# EAGLE design P27_v2 (EAGLE 6.4)
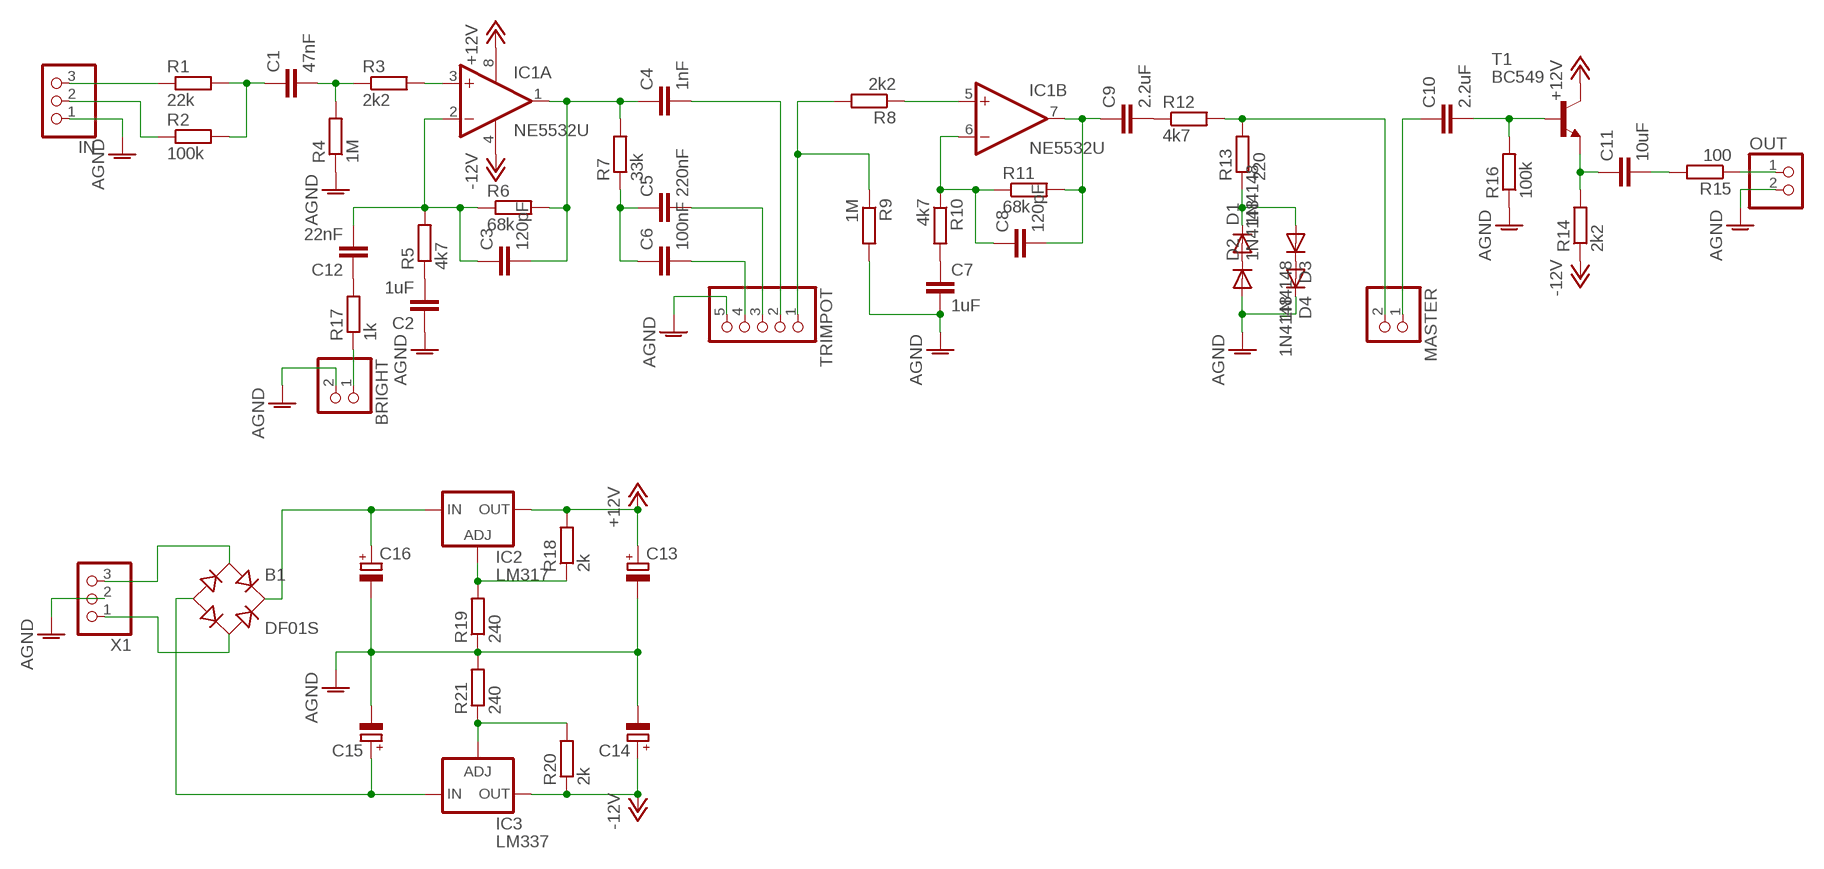
[diagram p0: schematic, sheet 1]

## Parts
B1  DF01S  [DFS]
BRIGHT  PINHD-1X2  [1X02]
C1  47nF  C-EUC0805K  [C0805K]
C2  1uF  C-EUC0805K  [C0805K]
C3  120pF  C-EUC0805K  [C0805K]
C4  1nF  C-EUC0805K  [C0805K]
C5  220nF  C-EUC0805K  [C0805K]
C6  100nF  C-EUC0805K  [C0805K]
C7  1uF  C-EUC0805K  [C0805K]
C8  120pF  C-EUC0805K  [C0805K]
C9  2.2uF  C-EUC1206  [C1206]
C10  2.2uF  C-EUC1206  [C1206]
C11  10uF  C-EUC1206  [C1206]
C12  22nF  C-EUC0805K  [C0805K]
C13  CPOL-EUD  [PANASONIC_D]
C14  CPOL-EUD  [PANASONIC_D]
C15  CPOL-EUD  [PANASONIC_D]
C16  CPOL-EUD  [PANASONIC_D]
D1  1N4148  [D0805]
D2  1N4148  [D0805]
D3  1N4148  [D0805]
D4  1N4148  [D0805]
IC1  NE5532U  [SO08]
IC2  LM317  [SOT223]
IC3  LM337  [SOT223]
IN  PINHD-1X3180  [1X03]
MASTER  PINHD-1X2  [1X02]
OUT  PINHD-1X2  [1X02]
R1  22k  R-EU_0805  [R0805]
R2  100k  R-EU_0805  [R0805]
R3  2k2  R-EU_0805  [R0805]
R4  1M  R-EU_0805  [R0805]
R5  4k7  R-EU_0805  [R0805]
R6  68k  R-EU_0805  [R0805]
R7  33k  R-EU_0805  [R0805]
R8  2k2  R-EU_0805  [R0805]
R9  1M  R-EU_0805  [R0805]
R10  4k7  R-EU_0805  [R0805]
R11  68k  R-EU_0805  [R0805]
R12  4k7  R-EU_0805  [R0805]
R13  220  R-EU_0805  [R0805]
R14  2k2  R-EU_0805  [R0805]
R15  100  R-EU_0805  [R0805]
R16  100k  R-EU_0805  [R0805]
R17  1k  R-EU_0805  [R0805]
R18  2k  R-EU_0805  [R0805]
R19  240  R-EU_0805  [R0805]
R20  2k  R-EU_0805  [R0805]
R21  240  R-EU_0805  [R0805]
T1  BC549  BC847  [SOT23]
TRIMPOT  PINHD-1X5  [1X05]
X1  W237-103  [W237-103]

## Nets
+12V: C13.+ IC1.8(A:V+) IC2.2(OUT) IC2.4(OUT) R18.2 T1.3(C)
-12V: C14.+ IC1.4(A:V-) IC3.3(OUT) R14.1 R20.1
AGND: BRIGHT.2 C2.1 C7.2 C13.- C14.- C15.- C16.- D2.A D4.K(C) IN.1 OUT.2 R4.1 R9.2 R16.1 R19.1 R21.2 TRIMPOT.5 X1.2
N$1: C1.1 R1.2 R2.2
N$2: IC1.3(A:+IN) R3.2
N$3: C1.2 R3.1 R4.2
N$4: C3.1 C12.2 IC1.2(A:-IN) R5.2 R6.1
N$5: C2.2 R5.1
N$6: C3.2 C4.1 IC1.1(A:OUT) R6.2 R7.2
N$7: C6.2 TRIMPOT.4
N$8: C5.1 C6.1 R7.1
N$9: C5.2 TRIMPOT.3
N$10: C4.2 TRIMPOT.2
N$11: C10.2 R16.2 T1.1(B)
N$12: C7.1 R10.2
N$13: R8.2 R9.1 TRIMPOT.1
N$14: IC1.5(B:+IN) R8.1
N$15: C11.1 R14.2 T1.2(E)
N$16: C11.2 R15.2
N$17: C8.1 IC1.6(B:-IN) R10.1 R11.1
N$18: C8.2 C9.1 IC1.7(B:OUT) R11.2
N$19: OUT.1 R15.1
N$20: C9.2 R12.1
N$21: MASTER.2 R12.2 R13.2
N$22: D1.A D2.K(C)
N$23: D3.K(C) D4.A
N$24: D1.K(C) D3.A R13.1
N$25: IN.3 R1.1
N$26: IN.2 R2.1
N$27: C10.1 MASTER.1
N$28: B1.AC1 X1.3
N$29: C12.1 R17.2
N$30: BRIGHT.1 R17.1
N$31: B1.AC2 X1.1
N$32: B1.+ C16.+ IC2.3(IN)
N$33: B1.- C15.+ IC3.2(IN) IC3.4(IN)
N$34: IC2.1(ADJ) R18.1 R19.2
N$38: IC3.1(ADJ) R20.2 R21.1

## Library data of the parts
B1 = P27:DF*S: Surface Mount Glass Passivated Bridge Rectifiers Source: Source: Comchip Bridge Rectifiers DF005S-G thru DF10S-G.pdf
BRIGHT MASTER OUT = P27:PINHD-1X2: PIN HEADER
C1-C12 = P27:C-EU: CAPACITOR, European symbol
C13-C16 = P27:CPOL-EU: POLARIZED CAPACITOR, European symbol
D1-D4 = P27:1N4148: DIODE general purpose rectifier, 1 A
IC1 = P27:NE5532: Dual Operational Amplifier Low Power, Single-Supply, Rail-To-Rail Operational Amplifier Source: http://focus.ti.com/lit/ds/symlink/opa2345.pdf http://focus.ti.com .. opa241.pdf http://focus.ti.com/lit/ds/symlink/opa2134.pdf
IC2 = P27:LM317: 500 mA Adjustable Output Positive Voltage Regulator Source: http://www.onsemi.co.jp .. LM317M-D.PDF
IC3 = P27:LM337
IN = P27:PINHD-1X3: PIN HEADER
R1-R21 = P27:R-EU_: RESISTOR, European symbol
T1 = P27:BC847: NPN TRANSISTOR
TRIMPOT = P27:PINHD-1X5: PIN HEADER
X1 = P27:W237-103: WAGO SCREW CLAMP

## Board
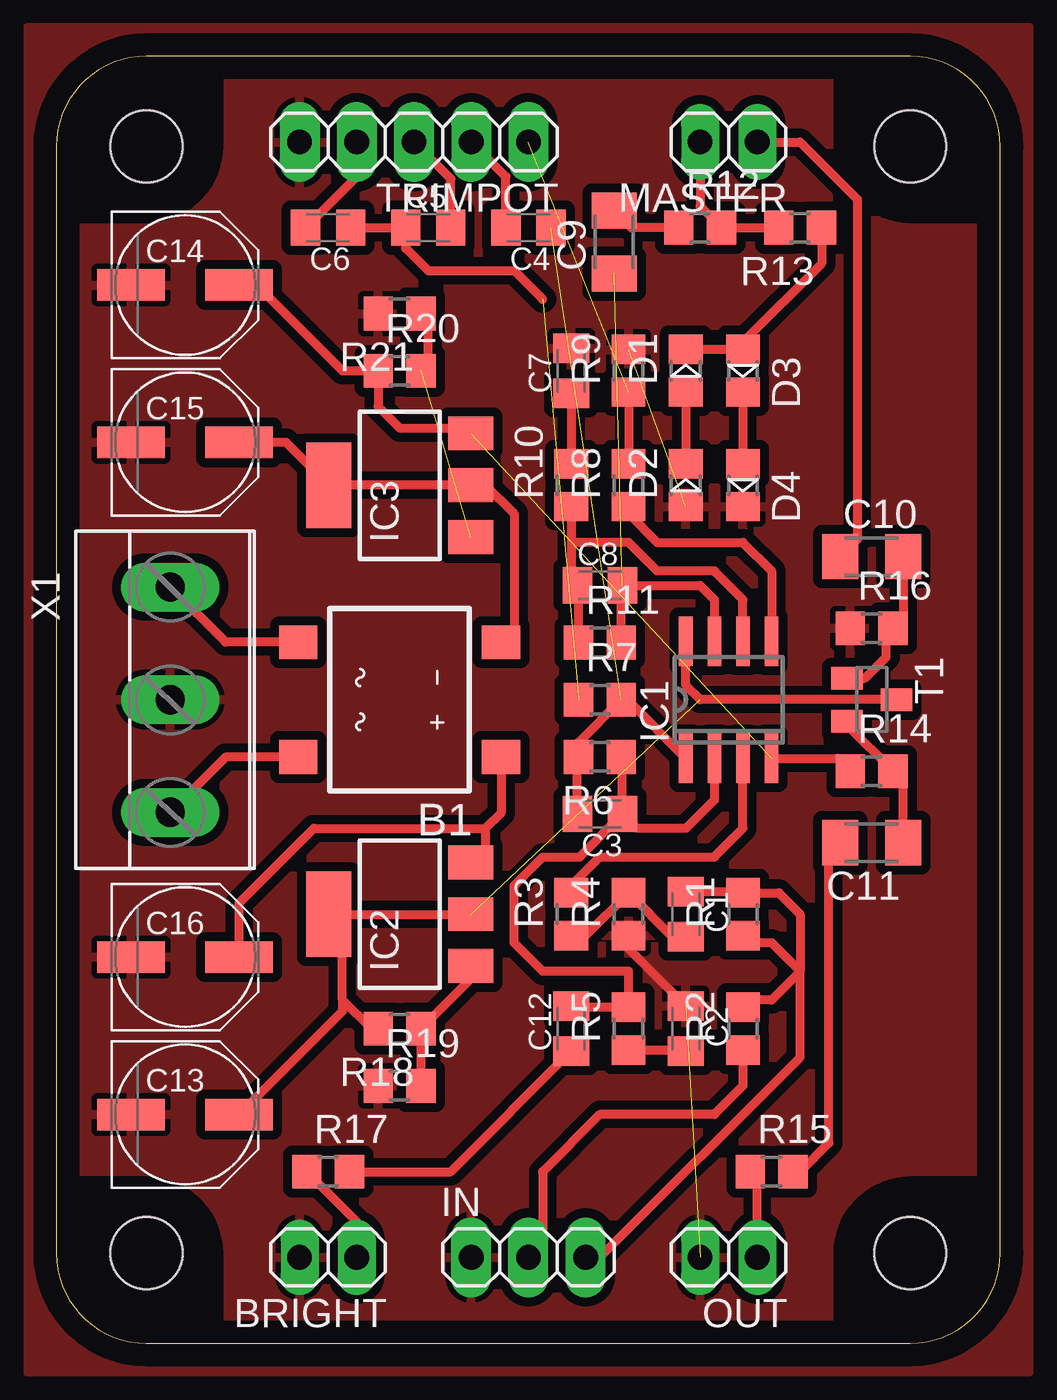
[diagram p1: board, top side]
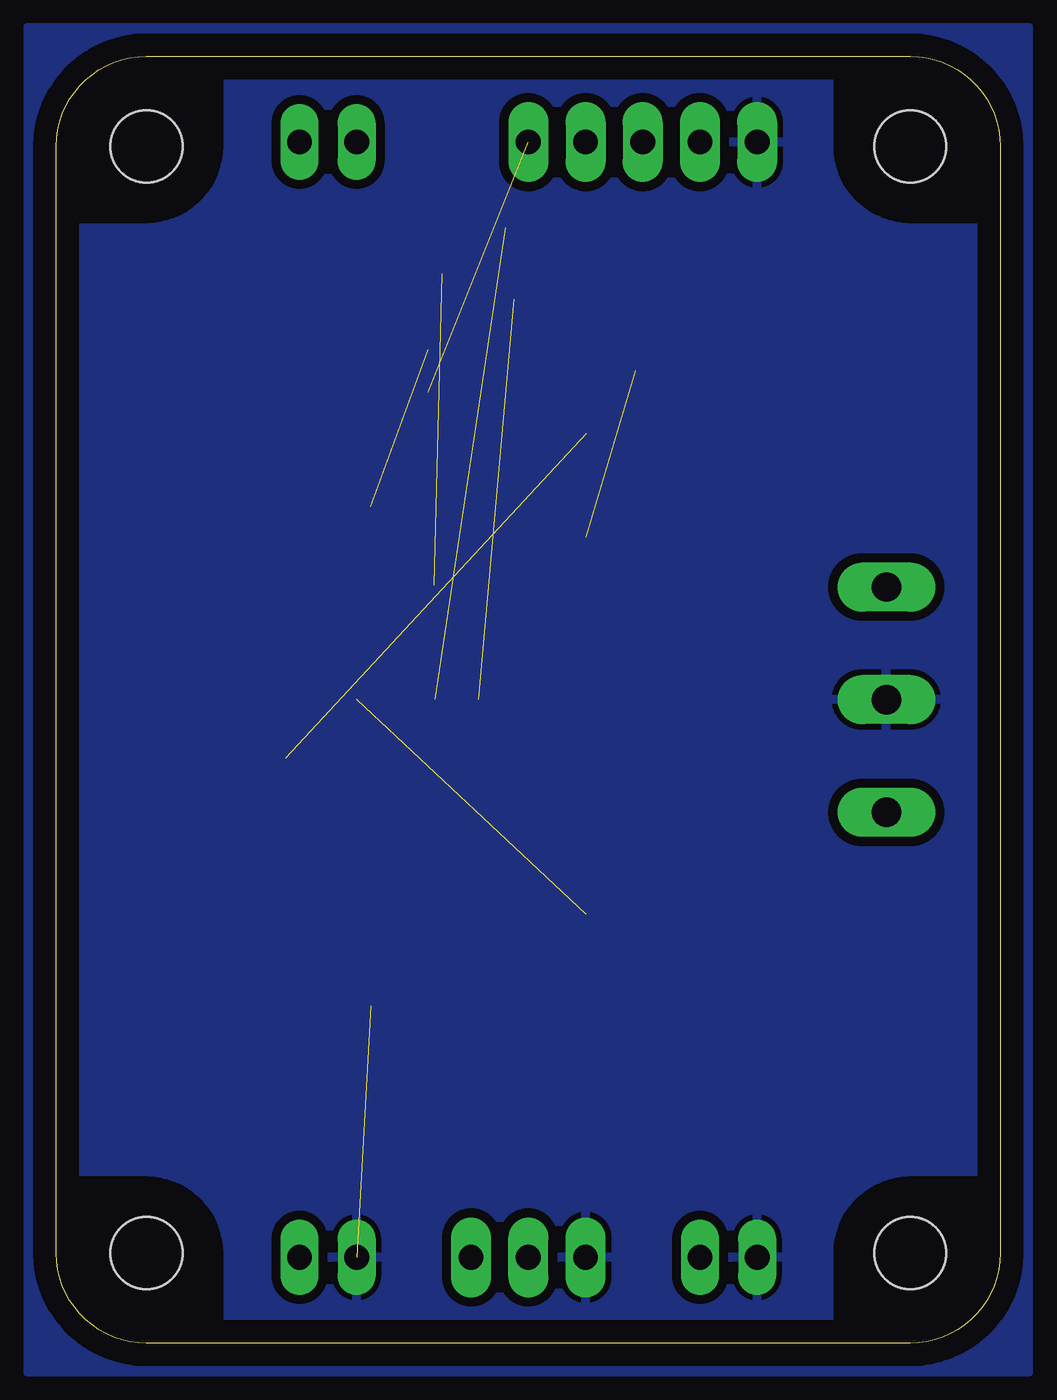
[diagram p2: board, bottom side, seen from below]

Size 41.91 x 57.14 mm. Coordinates in mm from the lower left corner, seen from the top.
Outline: 4,0 37.91,0 arc90 41.91,4 41.91,53.14 arc90 37.91,57.14 4,57.14 arc90 0,53.14 0,4 arc90 4,0
Copper layers (1*16): Top 0.035mm / dielectric 1.5mm / Bottom 0.035mm
Design rules "default": minimum track width 10mil, minimum drill 24mil, track to track 8mil, track to pad 8mil, pad to pad 8mil, via to via 8mil, smd to smd 8mil, copper to edge 40mil, drill to drill 8mil, minimum pad ring 10mil, minimum via ring 8mil, stop-mask expansion 4mil, vias tented up to drill 0mil, thermal gap 10mil
Holes 3.2 mm at 4,4 37.91,4 37.91,53.14 4,53.14
tKeepout: 8 lines
bKeepout: 6 lines
tRestrict: area 0,50.1 to 7,57.1; area 0,0 to 7,7; area 34.9,0 to 41.9,7; area 34.9,50.1 to 41.9,57.1
bRestrict: area 0,50.1 to 7,57.1; area 0,0 to 7,7; area 34.9,0 to 41.9,7; area 34.9,50.1 to 41.9,57.1
vRestrict: area 0,50.1 to 7,57.1; area 0,0 to 7,7; area 34.9,0 to 41.9,7; area 34.9,50.1 to 41.9,57.1

### Footprints (pad centres in the part's own frame; a part is rotated, then mirrored left to right if it is on the bottom)
DFS = smd 1.5 x 1.7: + -2.55,-4.5; - 2.55,-4.5; AC1 -2.55,4.5; AC2 2.55,4.5
1X02 = drill 1.1 pad 1.676 long: 1 -1.27,0; 2 1.27,0
C0805K = smd 1.3 x 1.6: 1 -1,0; 2 1,0
C1206 = smd 1.6 x 2: 1 -1.4,0; 2 1.4,0
PANASONIC_D = smd 3 x 1.4: + 2.4,0; - -2.4,0
D0805 = smd 1.3 x 1.5: A -0.95,0; K 0.95,0
SO08 = smd 0.6 x 2.2: 1 -1.905,-2.6; 2 -0.635,-2.6; 3 0.635,-2.6; 4 1.905,-2.6; 5 1.905,2.6; 6 0.635,2.6; 7 -0.635,2.6; 8 -1.905,2.6
SOT223 = smd 1.5 x 2: 1 -2.3,-3.15; 2 0,-3.15; 3 2.3,-3.15 | smd 3.8 x 2: 4 0,3.15
1X03 = drill 1.1 pad 1.778 long: 1 -2.54,0; 2 0,0; 3 2.54,0
R0805 = smd 1.3 x 1.5: 1 -0.95,0; 2 0.95,0
SOT23 = smd 1 x 1.4: 1 -0.95,-1.1; 2 0.95,-1.1; 3 0,1.1
1X05 = drill 1.1 pad 1.778 long: 1 -5.08,0; 2 -2.54,0; 3 0,0; 4 2.54,0; 5 5.08,0
W237-103 = drill 1.3 pad 2.184 long: 1 -5,-1.29; 2 0,-1.29; 3 5,-1.29

### Placement (x,y rotation side)
B1  15.24,28.57 90 top
BRIGHT  12.06,3.81 180 top
C1  27.94,19.05 270 top
C2  27.94,13.97 270 top
C3  24.13,23.49 180 top
C4  20.95,49.53 180 top
C5  16.51,49.53 0 top
C6  12.06,49.53 180 top
C7  22.86,43.18 90 top
C8  24.13,33.66 0 top
C9  24.77,48.89 90 top
C10  36.2,34.92 0 top
C11  36.2,22.22 180 top
C12  22.86,13.97 90 top
C13  5.71,10.16 0 top
C14  5.71,46.99 0 top
C15  5.71,40.01 0 top
C16  5.71,17.14 0 top
D1  27.94,43.18 90 top
D2  27.94,38.1 90 top
D3  30.48,43.18 270 top
D4  30.48,38.1 270 top
IC1  29.84,28.57 0 top
IC2  15.24,19.05 90 top
IC3  15.24,38.1 90 top
IN  20.95,3.81 0 top
MASTER  29.84,53.34 180 top
OUT  29.84,3.81 180 top
R1  30.48,19.05 90 top
R2  30.48,13.97 90 top
R3  22.86,19.05 90 top
R4  25.4,19.05 90 top
R5  25.4,13.97 90 top
R6  24.13,26.04 180 top
R7  24.13,28.57 0 top
R8  25.4,38.1 90 top
R9  25.4,43.18 90 top
R10  22.86,38.1 90 top
R11  24.13,31.11 0 top
R12  28.57,49.53 0 top
R13  33.02,49.53 180 top
R14  36.2,25.4 0 top
R15  31.75,7.62 0 top
R16  36.2,31.75 0 top
R17  12.06,7.62 0 top
R18  15.24,13.97 180 top
R19  15.24,11.43 0 top
R20  15.24,43.18 0 top
R21  15.24,45.72 180 top
T1  36.2,28.57 270 top
TRIMPOT  15.88,53.34 180 top
X1  6.35,28.57 270 top

### Tracks (layer width: path | path; a pad name or v marks a point on that pad's centre or on a via)
+12V  (1 unrouted)
  Top 0.406: IC2.4 12.7,19.05 | 12.7,19.05 IC2.2 | R18.2 13.97,13.97 12.7,15.24 | 12.7,15.24 12.7,19.05 | 12.7,15.24 12.7,14.75 C13.+ | T1.3 28.57,28.57 27.94,29.21 IC1.8
-12V  (1 unrouted)
  Top 0.406: C14.+ 8.89,46.99 12.7,43.18 R20.1 14.29,41.59 15.24,40.64 18.15,40.64 IC3.3 | IC1.4 34.67,25.97 R14.1
AGND  (2 unrouted)
  Top 0.406: R4.1 25.4,17.51 C2.1
  pour Top (isolate 0.406): -1.27,58.42 -1.27,-1.27 43.18,-1.27 43.18,58.42
  pour Bottom (isolate 0.406): -1.27,-1.27 -1.27,58.42 43.18,58.42 43.18,-1.27
N$1
  Top 0.406: C1.1 30.43,20.05 R1.2 32.07,20 33.02,19.05 33.02,16.51 31.75,15.24 30.8,15.24 R2.2
N$2
  Top 0.406: R3.2 22.86,20.32 24.13,21.59 29.21,21.59 30.48,22.86 IC1.3
N$3
  Top 0.406: R3.1 23.5,18.1 R4.2 27.35,18.05 C1.2
N$4
  Top 0.406: C12.2 22.91,14.92 R5.2 25.4,16.51 21.59,16.51 20.32,17.78 20.32,20.32 21.59,21.59 23.23,21.59 C3.1 | C3.1 25.13,25.98 R6.1 | IC1.2 29.21,24.13 27.94,22.86 25.77,22.86 C3.1
N$5
  Top 0.406: R5.1 27.89,13.02 C2.2
N$6  (1 unrouted)
  Top 0.406: C3.2 23.13,25.98 R6.2 23.18,26.68 R7.2 25.34,28.57 IC1.1
N$7
  Top 0.406: TRIMPOT.4 13.34,51.8 C6.2
N$8  (1 unrouted)
  Top 0.406: C6.1 C5.1 15.51,48.62 16.51,47.62 20.32,47.62 21.59,46.35
N$9
  Top 0.406: C5.2 17.51,51.7 TRIMPOT.3
N$10
  Top 0.406: C4.2 19.95,51.8 TRIMPOT.2
N$11
  Top 0.406: T1.1 35.88,29.52 36.83,30.48 36.83,31.43 R16.2 37.59,32.2 C10.2
N$12
  Top 0.406: C7.1 R10.2
N$13  (1 unrouted)
  Top 0.406: R9.1 R8.2
N$14
  Top 0.406: R8.1 25.4,36.83 26.67,35.56 30.48,35.56 31.75,34.29 IC1.5
N$15
  Top 0.406: C11.1 37.59,24.95 R14.2 35.09,27.45 T1.2
N$16
  Top 0.406: R15.2 33.02,7.62 34.29,8.89 34.29,21.72 C11.2
N$17
  Top 0.406: R11.1 23.18,33.61 C8.1 22.86,33.93 22.86,35.56 | R10.1 22.86,35.56 | IC1.6 30.48,33.02 29.21,34.29 26.67,34.29 25.4,35.56 22.86,35.56
N$18  (1 unrouted)
  Top 0.406: R11.2 25.08,33.61 C8.2 28.57,33.66 29.21,33.02 IC1.7
N$19
  Top 0.406: OUT.1 31.11,7.3 R15.1
N$20
  Top 0.406: R12.1 25.53,49.53 C9.2
N$21
  Top 0.406: MASTER.2 28.57,50.48 R12.2 R13.2
N$22
  Top 0.406: D1.A D2.K
N$23
  Top 0.406: D3.K D4.A
N$24
  Top 0.406: D1.K D3.A 30.48,44.45 33.97,47.94 R13.1
N$25
  Top 0.406: IN.3 24.13,3.81 33.02,12.7 33.02,16.51 31.75,17.78 30.8,17.78 R1.1
N$26
  Top 0.406: R2.1 30.48,11.43 29.21,10.16 24.13,10.16 21.59,7.62 21.59,4.45 IN.2
N$27
  Top 0.406: MASTER.1 33.02,53.34 35.56,50.8 35.56,35.69 C10.1
N$28
  Top 0.406: B1.AC1 7.51,26.02 X1.3
N$29
  Top 0.406: R17.2 17.51,7.62 C12.1
N$30
  Top 0.406: BRIGHT.1 13.34,5.4 R17.1
N$31
  Top 0.406: B1.AC2 7.51,31.12 X1.1
N$32
  Top 0.406: C16.+ 8.12,19.54 11.43,22.86 19.05,22.86 | 19.05,22.86 19.05,22.01 IC2.3 | B1.+ 19.74,23.55 19.05,22.86
N$33
  Top 0.406: C15.+ 10.19,40.01 IC3.4 IC3.2 19.05,38.1 20.32,36.83 20.32,31.7 B1.-
N$34
  Top 0.406: R19.2 R18.1 18.39,16.17 IC2.1
N$38  (1 unrouted)
  Top 0.406: R20.2 16.51,43.18 16.51,45.72 R21.1